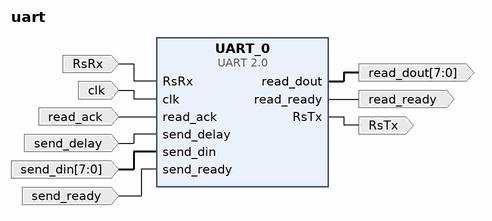
[diagram p0: block diagram of the top level]
# Vivado block design uart, xc7a35tcpg236-1, Vivado 2017.2
create_bd_design uart

create_bd_port -dir I RsRx
create_bd_port -dir O RsTx
create_bd_port -dir I -type clk clk
create_bd_port -dir I read_ack
create_bd_port -dir O -from 7 -to 0 read_dout
create_bd_port -dir O read_ready
create_bd_port -dir I send_delay
create_bd_port -dir I -from 7 -to 0 send_din
create_bd_port -dir I send_ready

create_bd_cell -type ip -vlnv xilinx.com:user:UART:2.0 UART_0

# ---- connections ----

connect_bd_net [get_bd_ports RsRx] [get_bd_pins UART_0/RsRx]
connect_bd_net [get_bd_ports clk] [get_bd_pins UART_0/clk]
connect_bd_net [get_bd_ports read_ack] [get_bd_pins UART_0/read_ack]
connect_bd_net [get_bd_ports send_delay] [get_bd_pins UART_0/send_delay]
connect_bd_net [get_bd_ports send_din] [get_bd_pins UART_0/send_din]
connect_bd_net [get_bd_ports send_ready] [get_bd_pins UART_0/send_ready]
connect_bd_net [get_bd_pins UART_0/RsTx] [get_bd_ports RsTx]
connect_bd_net [get_bd_pins UART_0/read_ready] [get_bd_ports read_ready]
connect_bd_net [get_bd_pins UART_0/read_dout] [get_bd_ports read_dout]

validate_bd_design
save_bd_design
